# EAGLE design emg_pcb_v1 (EAGLE 9.6.2)
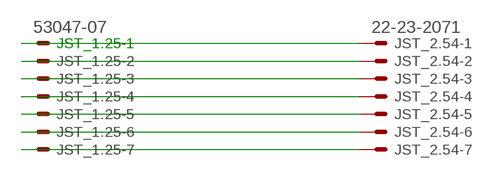
[diagram p0: schematic, sheet 1]

## Parts
JST_1.25  53047-07  [53047-07]
JST_2.54  22-23-2071  [22-23-2071]

## Nets
CS: JST_1.25.7 JST_2.54.7
GND: JST_1.25.1 JST_2.54.1
OUT1: JST_1.25.3 JST_2.54.3
OUT2: JST_1.25.4 JST_2.54.4
SCK: JST_1.25.5 JST_2.54.5
SI: JST_1.25.6 JST_2.54.6
VCC: JST_1.25.2 JST_2.54.2

## Library data of the parts
JST_1.25 = con-molex:53?-07: CONNECTOR wire to board 1.25 mm (.049 inch) pitch header; MF: MOLEX; MPN: 53047-0710-C; OC_FARNELL: 9732870; OC_NEWARK: 11M0149
JST_2.54 = con-molex:22-23-2071: .100" (2.54mm) Center Header - 7 Pin; MF: MOLEX; MPN: 22-23-2071; OC_FARNELL: 1654534; OC_NEWARK: 56H0445

## Board
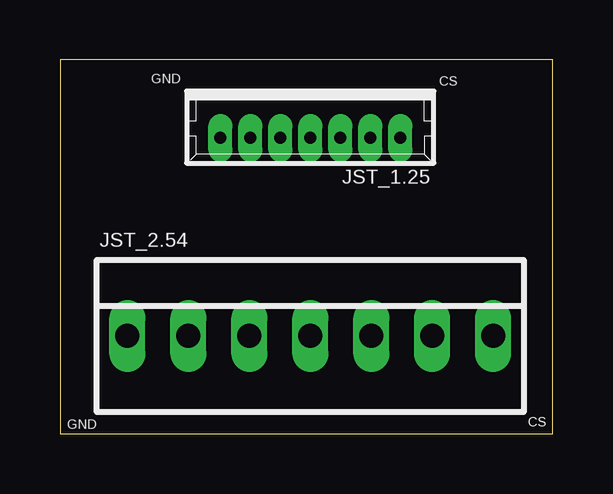
[diagram p1: board, top side]
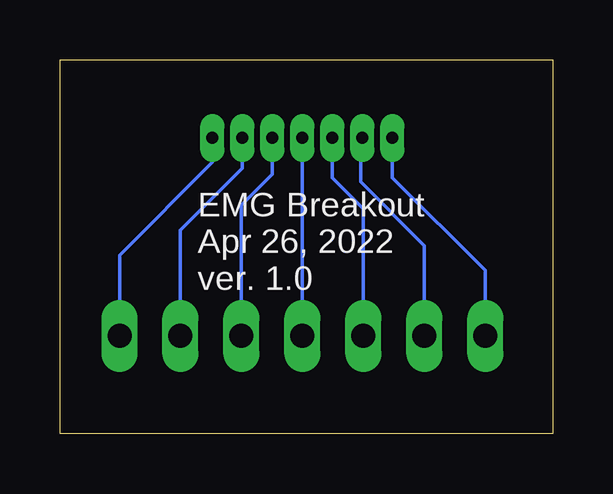
[diagram p2: board, bottom side, seen from below]

Size 20.53 x 15.58 mm. Coordinates in mm from the lower left corner, seen from the top.
Outline: 0,0 20.53,0 20.53,15.58 0,15.58 0,0
Copper layers (1*16): Top 0.035mm / dielectric 1.5mm / Bottom 0.035mm
Design rules "default": minimum track width 6mil, minimum drill 0.35mm, track to track 6mil, track to pad 6mil, pad to pad 6mil, via to via 6mil, smd to smd 6mil, copper to edge 40mil, drill to drill 6mil, minimum pad ring 10mil, minimum via ring 8mil, stop-mask expansion 4mil, vias tented up to drill 0mil, thermal gap 10mil

### Footprints (pad centres in the part's own frame; a part is rotated, then mirrored left to right if it is on the bottom)
53047-07 = drill 0.5 pad 0.698 long: 1 3.75,0.45; 2 2.5,0.45; 3 1.25,0.45; 4 0,0.45; 5 -1.25,0.45; 6 -2.5,0.45; 7 -3.75,0.45
22-23-2071 = drill 1 long: 1 -7.62,0; 2 -5.08,0; 3 -2.54,0; 4 0,0; 5 2.54,0; 6 5.08,0; 7 7.62,0

### Placement (x,y rotation side)
JST_1.25  10.43,12.78 180 top
JST_2.54  10.43,4.08 0 top

### Tracks (layer width: path | path; a pad name or v marks a point on that pad's centre or on a via)
CS
  Bottom 0.152: JST_2.54.7 18.05,7.45 14.18,11.32 JST_1.25.7
GND
  Bottom 0.152: JST_2.54.1 2.81,6.81 6.68,10.68 JST_1.25.1
OUT1
  Bottom 0.152: JST_2.54.3 7.89,9.39 9.18,10.68 JST_1.25.3
OUT2
  Bottom 0.152: JST_2.54.4 JST_1.25.4
SCK
  Bottom 0.152: JST_2.54.5 12.97,9.53 11.68,10.82 JST_1.25.5
SI
  Bottom 0.152: JST_2.54.6 15.51,8.49 12.93,11.07 JST_1.25.6
VCC
  Bottom 0.152: JST_2.54.2 5.35,7.85 8,10.5 8,12.26 JST_1.25.2

### Text on the board
tPlace: GND | CS | GND | CS
bPlace: EMG Breakout / Apr 26, 2022 / ver. 1.0